# Altium schematic sheet WPL1321A(V1.0).SchDoc: WPL1321A(V1.0)
size A4 portrait; Revision: V1.0; PageSetup: Record=PageOptions|CenterHorizontal=True|CenterVertical=True|PrintScale=1.01|XCorrection=1.00|YCorrection=1.00|PrintKind=1|BorderSize=5000000|LeftOffset=0|BottomOffset=0|Orientation=2|PaperLength=1000|PaperWidth=1000|Scale=100|PaperSource=7|PrintQuality=600|MediaType=1|DitherType=10|PaperKind=A3|PrintScaleMode=1
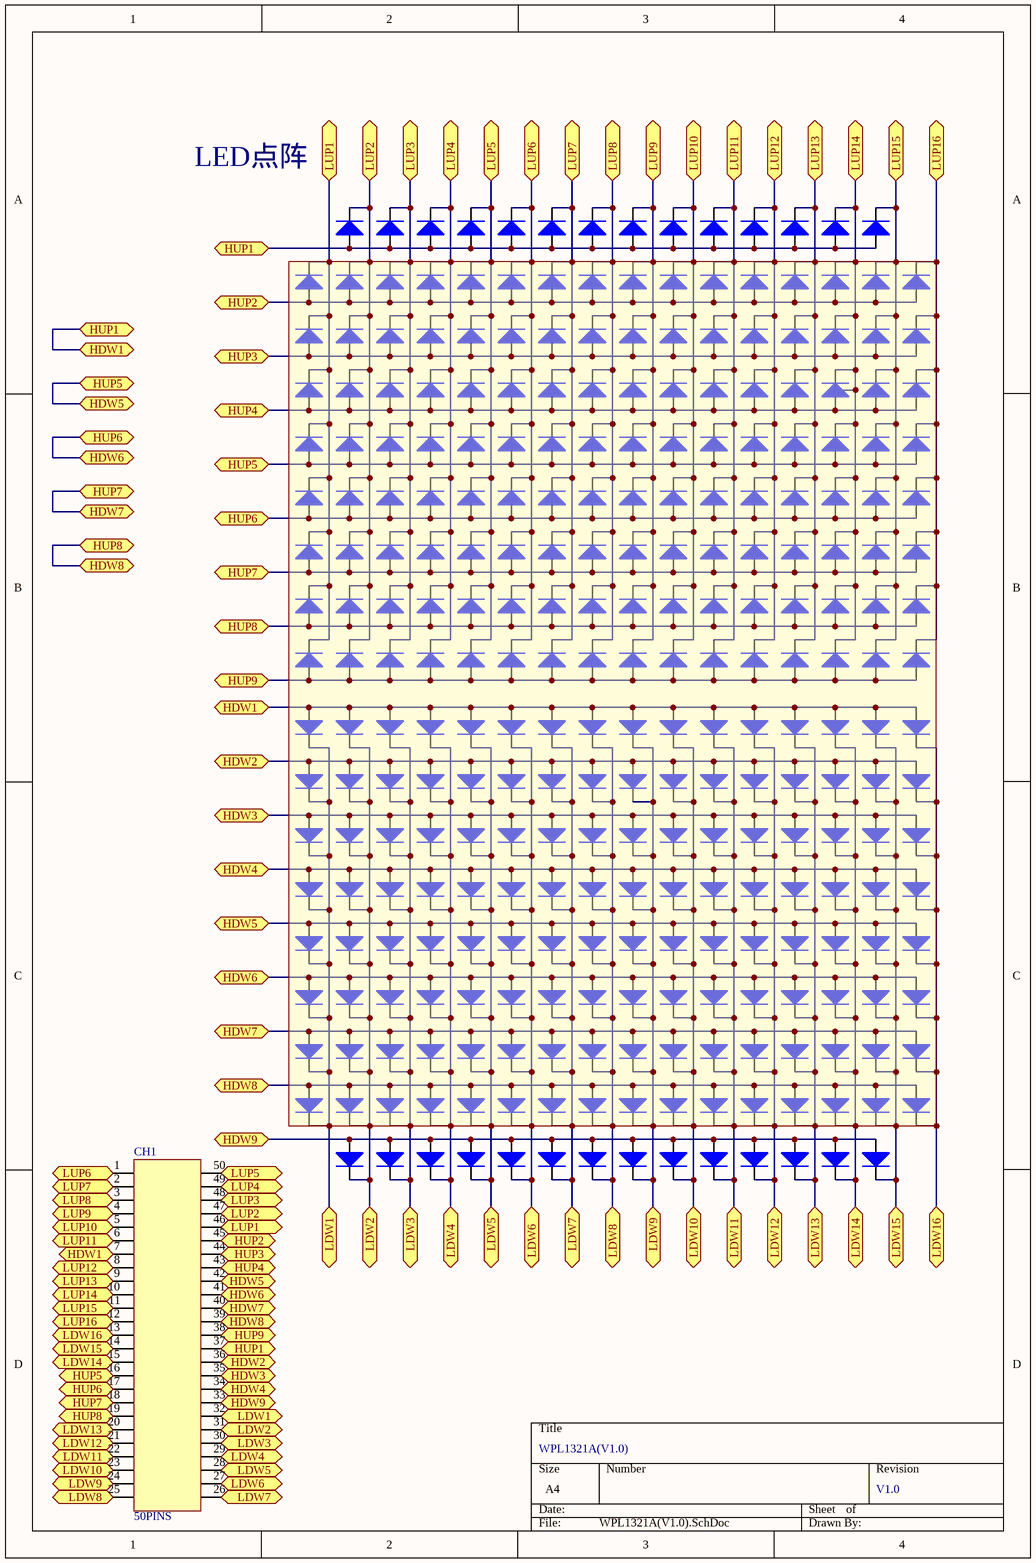
[diagram p0: WPL1321A(V1.0).SchDoc]

## Parts
CH1  50PINS  [50PINS]
D1  LED2  [RESC1608FL]  (value not drawn)
D2  LED2  [RESC1608FL]  (value not drawn)
D3  LED2  [RESC1608FL]  (value not drawn)
D4  LED2  [RESC1608FL]  (value not drawn)
D5  LED2  [RESC1608FL]  (value not drawn)
D6  LED2  [RESC1608FL]  (value not drawn)
D7  LED2  [RESC1608FL]  (value not drawn)
D8  LED2  [RESC1608FL]  (value not drawn)
D9  LED2  [RESC1608FL]  (value not drawn)
D10  LED2  [RESC1608FL]  (value not drawn)
D11  LED2  [RESC1608FL]  (value not drawn)
D12  LED2  [RESC1608FL]  (value not drawn)
D13  LED2  [RESC1608FL]  (value not drawn)
D14  LED2  [RESC1608FL]  (value not drawn)
D15  LED2  [RESC1608FL]  (value not drawn)
D16  LED2  [RESC1608FL]  (value not drawn)
D17  LED2  [RESC1608FL]  (value not drawn)
D18  LED2  [RESC1608FL]  (value not drawn)
D19  LED2  [RESC1608FL]  (value not drawn)
D20  LED2  [RESC1608FL]  (value not drawn)
D21  LED2  [RESC1608FL]  (value not drawn)
D22  LED2  [RESC1608FL]  (value not drawn)
D23  LED2  [RESC1608FL]  (value not drawn)
D24  LED2  [RESC1608FL]  (value not drawn)
D25  LED2  [RESC1608FL]  (value not drawn)
D26  LED2  [RESC1608FL]  (value not drawn)
D27  LED2  [RESC1608FL]  (value not drawn)
D28  LED2  [RESC1608FL]  (value not drawn)
D29  LED2  [RESC1608FL]  (value not drawn)
D30  LED2  [RESC1608FL]  (value not drawn)
D31  LED2  [RESC1608FL]  (value not drawn)
D32  LED2  [RESC1608FL]  (value not drawn)
D33  LED2  [RESC1608FL]  (value not drawn)
D34  LED2  [RESC1608FL]  (value not drawn)
D35  LED2  [RESC1608FL]  (value not drawn)
D36  LED2  [RESC1608FL]  (value not drawn)
D37  LED2  [RESC1608FL]  (value not drawn)
D38  LED2  [RESC1608FL]  (value not drawn)
D39  LED2  [RESC1608FL]  (value not drawn)
D40  LED2  [RESC1608FL]  (value not drawn)
D41  LED2  [RESC1608FL]  (value not drawn)
D42  LED2  [RESC1608FL]  (value not drawn)
D43  LED2  [RESC1608FL]  (value not drawn)
D44  LED2  [RESC1608FL]  (value not drawn)
D45  LED2  [RESC1608FL]  (value not drawn)
D46  LED2  [RESC1608FL]  (value not drawn)
D47  LED2  [RESC1608FL]  (value not drawn)
D48  LED2  [RESC1608FL]  (value not drawn)
D49  LED2  [RESC1608FL]  (value not drawn)
D50  LED2  [RESC1608FL]  (value not drawn)
D51  LED2  [RESC1608FL]  (value not drawn)
D52  LED2  [RESC1608FL]  (value not drawn)
D53  LED2  [RESC1608FL]  (value not drawn)
D54  LED2  [RESC1608FL]  (value not drawn)
D55  LED2  [RESC1608FL]  (value not drawn)
D56  LED2  [RESC1608FL]  (value not drawn)
D57  LED2  [RESC1608FL]  (value not drawn)
D58  LED2  [RESC1608FL]  (value not drawn)
D59  LED2  [RESC1608FL]  (value not drawn)
D60  LED2  [RESC1608FL]  (value not drawn)
D61  LED2  [RESC1608FL]  (value not drawn)
D62  LED2  [RESC1608FL]  (value not drawn)
D63  LED2  [RESC1608FL]  (value not drawn)
D64  LED2  [RESC1608FL]  (value not drawn)
D65  LED2  [RESC1608FL]  (value not drawn)
D66  LED2  [RESC1608FL]  (value not drawn)
D67  LED2  [RESC1608FL]  (value not drawn)
D68  LED2  [RESC1608FL]  (value not drawn)
D69  LED2  [RESC1608FL]  (value not drawn)
D70  LED2  [RESC1608FL]  (value not drawn)
D71  LED2  [RESC1608FL]  (value not drawn)
D72  LED2  [RESC1608FL]  (value not drawn)
D73  LED2  [RESC1608FL]  (value not drawn)
D74  LED2  [RESC1608FL]  (value not drawn)
D75  LED2  [RESC1608FL]  (value not drawn)
D76  LED2  [RESC1608FL]  (value not drawn)
D77  LED2  [RESC1608FL]  (value not drawn)
D78  LED2  [RESC1608FL]  (value not drawn)
D79  LED2  [RESC1608FL]  (value not drawn)
D80  LED2  [RESC1608FL]  (value not drawn)
D81  LED2  [RESC1608FL]  (value not drawn)
D82  LED2  [RESC1608FL]  (value not drawn)
D83  LED2  [RESC1608FL]  (value not drawn)
D84  LED2  [RESC1608FL]  (value not drawn)
D85  LED2  [RESC1608FL]  (value not drawn)
D86  LED2  [RESC1608FL]  (value not drawn)
D87  LED2  [RESC1608FL]  (value not drawn)
D88  LED2  [RESC1608FL]  (value not drawn)
D89  LED2  [RESC1608FL]  (value not drawn)
D90  LED2  [RESC1608FL]  (value not drawn)
D91  LED2  [RESC1608FL]  (value not drawn)
D92  LED2  [RESC1608FL]  (value not drawn)
D93  LED2  [RESC1608FL]  (value not drawn)
D94  LED2  [RESC1608FL]  (value not drawn)
D95  LED2  [RESC1608FL]  (value not drawn)
D96  LED2  [RESC1608FL]  (value not drawn)
D97  LED2  [RESC1608FL]  (value not drawn)
D98  LED2  [RESC1608FL]  (value not drawn)
D99  LED2  [RESC1608FL]  (value not drawn)
D100  LED2  [RESC1608FL]  (value not drawn)
D101  LED2  [RESC1608FL]  (value not drawn)
D102  LED2  [RESC1608FL]  (value not drawn)
D103  LED2  [RESC1608FL]  (value not drawn)
D104  LED2  [RESC1608FL]  (value not drawn)
D105  LED2  [RESC1608FL]  (value not drawn)
D106  LED2  [RESC1608FL]  (value not drawn)
D107  LED2  [RESC1608FL]  (value not drawn)
D108  LED2  [RESC1608FL]  (value not drawn)
D109  LED2  [RESC1608FL]  (value not drawn)
D110  LED2  [RESC1608FL]  (value not drawn)
D111  LED2  [RESC1608FL]  (value not drawn)
D112  LED2  [RESC1608FL]  (value not drawn)
D113  LED2  [RESC1608FL]  (value not drawn)
D114  LED2  [RESC1608FL]  (value not drawn)
D115  LED2  [RESC1608FL]  (value not drawn)
D116  LED2  [RESC1608FL]  (value not drawn)
D117  LED2  [RESC1608FL]  (value not drawn)
D118  LED2  [RESC1608FL]  (value not drawn)
D119  LED2  [RESC1608FL]  (value not drawn)
D120  LED2  [RESC1608FL]  (value not drawn)
D121  LED2  [RESC1608FL]  (value not drawn)
D122  LED2  [RESC1608FL]  (value not drawn)
D123  LED2  [RESC1608FL]  (value not drawn)
D124  LED2  [RESC1608FL]  (value not drawn)
D125  LED2  [RESC1608FL]  (value not drawn)
D126  LED2  [RESC1608FL]  (value not drawn)
D127  LED2  [RESC1608FL]  (value not drawn)
D128  LED2  [RESC1608FL]  (value not drawn)
D129  LED2  [RESC1608FL]  (value not drawn)
D130  LED2  [RESC1608FL]  (value not drawn)
D131  LED2  [RESC1608FL]  (value not drawn)
D132  LED2  [RESC1608FL]  (value not drawn)
D133  LED2  [RESC1608FL]  (value not drawn)
D134  LED2  [RESC1608FL]  (value not drawn)
D135  LED2  [RESC1608FL]  (value not drawn)
D136  LED2  [RESC1608FL]  (value not drawn)
D137  LED2  [RESC1608FL]  (value not drawn)
D138  LED2  [RESC1608FL]  (value not drawn)
D139  LED2  [RESC1608FL]  (value not drawn)
D140  LED2  [RESC1608FL]  (value not drawn)
D141  LED2  [RESC1608FL]  (value not drawn)
D142  LED2  [RESC1608FL]  (value not drawn)
D144  LED2  [RESC1608FL]  (value not drawn)
D145  LED2  [RESC1608FL]  (value not drawn)
D146  LED2  [RESC1608FL]  (value not drawn)
D147  LED2  [RESC1608FL]  (value not drawn)
D148  LED2  [RESC1608FL]  (value not drawn)
D149  LED2  [RESC1608FL]  (value not drawn)
D150  LED2  [RESC1608FL]  (value not drawn)
D151  LED2  [RESC1608FL]  (value not drawn)
D152  LED2  [RESC1608FL]  (value not drawn)
D153  LED2  [RESC1608FL]  (value not drawn)
D154  LED2  [RESC1608FL]  (value not drawn)
D155  LED2  [RESC1608FL]  (value not drawn)
D156  LED2  [RESC1608FL]  (value not drawn)
D157  LED2  [RESC1608FL]  (value not drawn)
D158  LED2  [RESC1608FL]  (value not drawn)
D159  LED2  [RESC1608FL]  (value not drawn)
D161  LED2  [RESC1608FL]  (value not drawn)
D162  LED2  [RESC1608FL]  (value not drawn)
D163  LED2  [RESC1608FL]  (value not drawn)
D164  LED2  [RESC1608FL]  (value not drawn)
D165  LED2  [RESC1608FL]  (value not drawn)
D166  LED2  [RESC1608FL]  (value not drawn)
D167  LED2  [RESC1608FL]  (value not drawn)
D168  LED2  [RESC1608FL]  (value not drawn)
D169  LED2  [RESC1608FL]  (value not drawn)
D170  LED2  [RESC1608FL]  (value not drawn)
D171  LED2  [RESC1608FL]  (value not drawn)
D172  LED2  [RESC1608FL]  (value not drawn)
D173  LED2  [RESC1608FL]  (value not drawn)
D174  LED2  [RESC1608FL]  (value not drawn)
D175  LED2  [RESC1608FL]  (value not drawn)
D176  LED2  [RESC1608FL]  (value not drawn)
D177  LED2  [RESC1608FL]  (value not drawn)
D178  LED2  [RESC1608FL]  (value not drawn)
D179  LED2  [RESC1608FL]  (value not drawn)
D180  LED2  [RESC1608FL]  (value not drawn)
D181  LED2  [RESC1608FL]  (value not drawn)
D182  LED2  [RESC1608FL]  (value not drawn)
D183  LED2  [RESC1608FL]  (value not drawn)
D184  LED2  [RESC1608FL]  (value not drawn)
D185  LED2  [RESC1608FL]  (value not drawn)
D186  LED2  [RESC1608FL]  (value not drawn)
D187  LED2  [RESC1608FL]  (value not drawn)
D188  LED2  [RESC1608FL]  (value not drawn)
D189  LED2  [RESC1608FL]  (value not drawn)
D190  LED2  [RESC1608FL]  (value not drawn)
D191  LED2  [RESC1608FL]  (value not drawn)
D192  LED2  [RESC1608FL]  (value not drawn)
D193  LED2  [RESC1608FL]  (value not drawn)
D194  LED2  [RESC1608FL]  (value not drawn)
D195  LED2  [RESC1608FL]  (value not drawn)
D196  LED2  [RESC1608FL]  (value not drawn)
D197  LED2  [RESC1608FL]  (value not drawn)
D198  LED2  [RESC1608FL]  (value not drawn)
D199  LED2  [RESC1608FL]  (value not drawn)
D200  LED2  [RESC1608FL]  (value not drawn)
D201  LED2  [RESC1608FL]  (value not drawn)
D202  LED2  [RESC1608FL]  (value not drawn)
D203  LED2  [RESC1608FL]  (value not drawn)
D204  LED2  [RESC1608FL]  (value not drawn)
D205  LED2  [RESC1608FL]  (value not drawn)
D206  LED2  [RESC1608FL]  (value not drawn)
D207  LED2  [RESC1608FL]  (value not drawn)
D208  LED2  [RESC1608FL]  (value not drawn)
D209  LED2  [RESC1608FL]  (value not drawn)
D210  LED2  [RESC1608FL]  (value not drawn)
D211  LED2  [RESC1608FL]  (value not drawn)
D212  LED2  [RESC1608FL]  (value not drawn)
D213  LED2  [RESC1608FL]  (value not drawn)
D214  LED2  [RESC1608FL]  (value not drawn)
D215  LED2  [RESC1608FL]  (value not drawn)
D216  LED2  [RESC1608FL]  (value not drawn)
D217  LED2  [RESC1608FL]  (value not drawn)
D218  LED2  [RESC1608FL]  (value not drawn)
D219  LED2  [RESC1608FL]  (value not drawn)
D220  LED2  [RESC1608FL]  (value not drawn)
D221  LED2  [RESC1608FL]  (value not drawn)
D222  LED2  [RESC1608FL]  (value not drawn)
D223  LED2  [RESC1608FL]  (value not drawn)
D224  LED2  [RESC1608FL]  (value not drawn)
D225  LED2  [RESC1608FL]  (value not drawn)
D226  LED2  [RESC1608FL]  (value not drawn)
D227  LED2  [RESC1608FL]  (value not drawn)
D228  LED2  [RESC1608FL]  (value not drawn)
D229  LED2  [RESC1608FL]  (value not drawn)
D230  LED2  [RESC1608FL]  (value not drawn)
D231  LED2  [RESC1608FL]  (value not drawn)
D232  LED2  [RESC1608FL]  (value not drawn)
D233  LED2  [RESC1608FL]  (value not drawn)
D234  LED2  [RESC1608FL]  (value not drawn)
D235  LED2  [RESC1608FL]  (value not drawn)
D236  LED2  [RESC1608FL]  (value not drawn)
D237  LED2  [RESC1608FL]  (value not drawn)
D238  LED2  [RESC1608FL]  (value not drawn)
D239  LED2  [RESC1608FL]  (value not drawn)
D240  LED2  [RESC1608FL]  (value not drawn)
D241  LED2  [RESC1608FL]  (value not drawn)
D242  LED2  [RESC1608FL]  (value not drawn)
D243  LED2  [RESC1608FL]  (value not drawn)
D244  LED2  [RESC1608FL]  (value not drawn)
D245  LED2  [RESC1608FL]  (value not drawn)
D246  LED2  [RESC1608FL]  (value not drawn)
D247  LED2  [RESC1608FL]  (value not drawn)
D248  LED2  [RESC1608FL]  (value not drawn)
D249  LED2  [RESC1608FL]  (value not drawn)
D250  LED2  [RESC1608FL]  (value not drawn)
D251  LED2  [RESC1608FL]  (value not drawn)
D252  LED2  [RESC1608FL]  (value not drawn)
D253  LED2  [RESC1608FL]  (value not drawn)
D254  LED2  [RESC1608FL]  (value not drawn)
D255  LED2  [RESC1608FL]  (value not drawn)
D256  LED2  [RESC1608FL]  (value not drawn)
D257  LED2  [RESC1608FL]  (value not drawn)
D258  LED2  [RESC1608FL]  (value not drawn)
D259  LED2  [RESC1608FL]  (value not drawn)
D260  LED2  [RESC1608FL]  (value not drawn)
D261  LED2  [RESC1608FL]  (value not drawn)
D262  LED2  [RESC1608FL]  (value not drawn)
D263  LED2  [RESC1608FL]  (value not drawn)
D264  LED2  [RESC1608FL]  (value not drawn)
D265  LED2  [RESC1608FL]  (value not drawn)
D266  LED2  [RESC1608FL]  (value not drawn)
D267  LED2  [RESC1608FL]  (value not drawn)
D268  LED2  [RESC1608FL]  (value not drawn)
D269  LED2  [RESC1608FL]  (value not drawn)
D270  LED2  [RESC1608FL]  (value not drawn)
D271  LED2  [RESC1608FL]  (value not drawn)
D272  LED2  [RESC1608FL]  (value not drawn)
D273  LED2  [RESC1608FL]  (value not drawn)
D274  LED2  [RESC1608FL]  (value not drawn)
D275  LED2  [RESC1608FL]  (value not drawn)
D276  LED2  [RESC1608FL]  (value not drawn)
D277  LED2  [RESC1608FL]  (value not drawn)
D278  LED2  [RESC1608FL]  (value not drawn)
D279  LED2  [RESC1608FL]  (value not drawn)
D280  LED2  [RESC1608FL]  (value not drawn)
D281  LED2  [RESC1608FL]  (value not drawn)
D282  LED2  [RESC1608FL]  (value not drawn)
D283  LED2  [RESC1608FL]  (value not drawn)
D284  LED2  [RESC1608FL]  (value not drawn)
D285  LED2  [RESC1608FL]  (value not drawn)
D286  LED2  [RESC1608FL]  (value not drawn)

## Ports
HDW1 (bidir), HDW2 (bidir), HDW3 (bidir), HDW4 (bidir), HDW5 (bidir), HDW6 (bidir), HDW7 (bidir), HDW8 (bidir), HDW9 (bidir), HUP1 (bidir), HUP2 (bidir), HUP3 (bidir), HUP4 (bidir), HUP5 (bidir), HUP6 (bidir), HUP7 (bidir), HUP8 (bidir), HUP9 (bidir), LDW1 (bidir), LDW2 (bidir), LDW3 (bidir), LDW4 (bidir), LDW5 (bidir), LDW6 (bidir), LDW7 (bidir), LDW8 (bidir), LDW9 (bidir), LDW10 (bidir), LDW11 (bidir), LDW12 (bidir), LDW13 (bidir), LDW14 (bidir), LDW15 (bidir), LDW16 (bidir), LUP1 (bidir), LUP2 (bidir), LUP3 (bidir), LUP4 (bidir), LUP5 (bidir), LUP6 (bidir), LUP7 (bidir), LUP8 (bidir), LUP9 (bidir), LUP10 (bidir), LUP11 (bidir), LUP12 (bidir), LUP13 (bidir), LUP14 (bidir), LUP15 (bidir), LUP16 (bidir)

## Nets
HDW1: CH1.7 CH1.37 D1.1(A) D2.1(A) D3.1(A) D4.1(A) D5.1(A) D6.1(A) D7.1(A) D8.1(A) D9.1(A) D10.1(A) D11.1(A) D12.1(A) D13.1(A) D14.1(A) D144.1(A) D145.1(A) D146.1(A) D147.1(A) D148.1(A) D149.1(A) D150.1(A) D151.1(A) D152.1(A) D153.1(A) D154.1(A) D155.1(A) D156.1(A) D157.1(A) D158.1(A) D159.1(A) ; port HUP1, port HDW1
HDW2: CH1.36 D161.1(A) D162.1(A) D163.1(A) D164.1(A) D165.1(A) D166.1(A) D167.1(A) D168.1(A) D169.1(A) D170.1(A) D171.1(A) D172.1(A) D173.1(A) D174.1(A) D175.1(A) D176.1(A) ; port HDW2
HDW3: CH1.35 D177.1(A) D178.1(A) D179.1(A) D180.1(A) D181.1(A) D182.1(A) D183.1(A) D184.1(A) D185.1(A) D186.1(A) D187.1(A) D188.1(A) D189.1(A) D190.1(A) D191.1(A) D192.1(A) ; port HDW3
HDW4: CH1.34 D193.1(A) D194.1(A) D195.1(A) D196.1(A) D197.1(A) D198.1(A) D199.1(A) D200.1(A) D201.1(A) D202.1(A) D203.1(A) D204.1(A) D205.1(A) D206.1(A) D207.1(A) D208.1(A) ; port HDW4
HDW5: CH1.16 CH1.42 D63.1(A) D64.1(A) D65.1(A) D66.1(A) D67.1(A) D68.1(A) D69.1(A) D70.1(A) D71.1(A) D72.1(A) D73.1(A) D74.1(A) D75.1(A) D76.1(A) D77.1(A) D78.1(A) D209.1(A) D210.1(A) D211.1(A) D212.1(A) D213.1(A) D214.1(A) D215.1(A) D216.1(A) D217.1(A) D218.1(A) D219.1(A) D220.1(A) D221.1(A) D222.1(A) D223.1(A) D224.1(A) ; port HUP5, port HDW5
HDW6: CH1.17 CH1.41 D79.1(A) D80.1(A) D81.1(A) D82.1(A) D83.1(A) D84.1(A) D85.1(A) D86.1(A) D87.1(A) D88.1(A) D89.1(A) D90.1(A) D91.1(A) D92.1(A) D93.1(A) D94.1(A) D225.1(A) D226.1(A) D227.1(A) D228.1(A) D229.1(A) D230.1(A) D231.1(A) D232.1(A) D233.1(A) D234.1(A) D235.1(A) D236.1(A) D237.1(A) D238.1(A) D239.1(A) D240.1(A) ; port HUP6, port HDW6
HDW7: CH1.18 CH1.40 D95.1(A) D96.1(A) D97.1(A) D98.1(A) D99.1(A) D100.1(A) D101.1(A) D102.1(A) D103.1(A) D104.1(A) D105.1(A) D106.1(A) D107.1(A) D108.1(A) D109.1(A) D110.1(A) D241.1(A) D242.1(A) D243.1(A) D244.1(A) D245.1(A) D246.1(A) D247.1(A) D248.1(A) D249.1(A) D250.1(A) D251.1(A) D252.1(A) D253.1(A) D254.1(A) D255.1(A) D256.1(A) ; port HUP7, port HDW7
HDW8: CH1.19 CH1.39 D111.1(A) D112.1(A) D113.1(A) D114.1(A) D115.1(A) D116.1(A) D117.1(A) D118.1(A) D119.1(A) D120.1(A) D121.1(A) D122.1(A) D123.1(A) D124.1(A) D125.1(A) D126.1(A) D257.1(A) D258.1(A) D259.1(A) D260.1(A) D261.1(A) D262.1(A) D263.1(A) D264.1(A) D265.1(A) D266.1(A) D267.1(A) D268.1(A) D269.1(A) D270.1(A) D271.1(A) D272.1(A) ; port HUP8, port HDW8
HDW9: CH1.33 D273.1(A) D274.1(A) D275.1(A) D276.1(A) D277.1(A) D278.1(A) D279.1(A) D280.1(A) D281.1(A) D282.1(A) D283.1(A) D284.1(A) D285.1(A) D286.1(A) ; port HDW9
HUP2: CH1.45 D15.1(A) D16.1(A) D17.1(A) D18.1(A) D19.1(A) D20.1(A) D21.1(A) D22.1(A) D23.1(A) D24.1(A) D25.1(A) D26.1(A) D27.1(A) D28.1(A) D29.1(A) D30.1(A) ; port HUP2
HUP3: CH1.44 D31.1(A) D32.1(A) D33.1(A) D34.1(A) D35.1(A) D36.1(A) D37.1(A) D38.1(A) D39.1(A) D40.1(A) D41.1(A) D42.1(A) D43.1(A) D44.1(A) D45.1(A) D46.1(A) ; port HUP3
HUP4: CH1.43 D47.1(A) D48.1(A) D49.1(A) D50.1(A) D51.1(A) D52.1(A) D53.1(A) D54.1(A) D55.1(A) D56.1(A) D57.1(A) D58.1(A) D59.1(A) D60.1(A) D61.1(A) D62.1(A) ; port HUP4
HUP9: CH1.38 D127.1(A) D128.1(A) D129.1(A) D130.1(A) D131.1(A) D132.1(A) D133.1(A) D134.1(A) D135.1(A) D136.1(A) D137.1(A) D138.1(A) D139.1(A) D140.1(A) D141.1(A) D142.1(A) ; port HUP9
LDW1: CH1.32 D144.2(K) D161.2(K) D177.2(K) D193.2(K) D209.2(K) D225.2(K) D241.2(K) D257.2(K) ; port LDW1
LDW2: CH1.31 D145.2(K) D162.2(K) D178.2(K) D194.2(K) D210.2(K) D226.2(K) D242.2(K) D258.2(K) D273.2(K) ; port LDW2
LDW3: CH1.30 D146.2(K) D163.2(K) D179.2(K) D195.2(K) D211.2(K) D227.2(K) D243.2(K) D259.2(K) D274.2(K) ; port LDW3
LDW4: CH1.29 D147.2(K) D164.2(K) D180.2(K) D196.2(K) D212.2(K) D228.2(K) D244.2(K) D260.2(K) D275.2(K) ; port LDW4
LDW5: CH1.28 D148.2(K) D165.2(K) D181.2(K) D197.2(K) D213.2(K) D229.2(K) D245.2(K) D261.2(K) D276.2(K) ; port LDW5
LDW6: CH1.27 D149.2(K) D166.2(K) D182.2(K) D198.2(K) D214.2(K) D230.2(K) D246.2(K) D262.2(K) D277.2(K) ; port LDW6
LDW7: CH1.26 D150.2(K) D167.2(K) D183.2(K) D199.2(K) D215.2(K) D231.2(K) D247.2(K) D263.2(K) D278.2(K) ; port LDW7
LDW8: CH1.25 D151.2(K) D168.2(K) D184.2(K) D200.2(K) D216.2(K) D232.2(K) D248.2(K) D264.2(K) D279.2(K) ; port LDW8
LDW9: CH1.24 D152.2(K) D169.2(K) D185.2(K) D201.2(K) D217.2(K) D233.2(K) D249.2(K) D265.2(K) D280.2(K) ; port LDW9
LDW10: CH1.23 D153.2(K) D170.2(K) D186.2(K) D202.2(K) D218.2(K) D234.2(K) D250.2(K) D266.2(K) D281.2(K) ; port LDW10
LDW11: CH1.22 D154.2(K) D171.2(K) D187.2(K) D203.2(K) D219.2(K) D235.2(K) D251.2(K) D267.2(K) D282.2(K) ; port LDW11
LDW12: CH1.21 D155.2(K) D172.2(K) D188.2(K) D204.2(K) D220.2(K) D236.2(K) D252.2(K) D268.2(K) D283.2(K) ; port LDW12
LDW13: CH1.20 D156.2(K) D173.2(K) D189.2(K) D205.2(K) D221.2(K) D237.2(K) D253.2(K) D269.2(K) D284.2(K) ; port LDW13
LDW14: CH1.15 D157.2(K) D174.2(K) D190.2(K) D206.2(K) D222.2(K) D238.2(K) D254.2(K) D270.2(K) D285.2(K) ; port LDW14
LDW15: CH1.14 D158.2(K) D175.2(K) D191.2(K) D207.2(K) D223.2(K) D239.2(K) D255.2(K) D271.2(K) D286.2(K) ; port LDW15
LDW16: CH1.13 D159.2(K) D176.2(K) D192.2(K) D208.2(K) D224.2(K) D240.2(K) D256.2(K) D272.2(K) ; port LDW16
LUP1: CH1.46 D15.2(K) D31.2(K) D47.2(K) D63.2(K) D79.2(K) D95.2(K) D111.2(K) D127.2(K) ; port LUP1
LUP2: CH1.47 D1.2(K) D16.2(K) D32.2(K) D48.2(K) D64.2(K) D80.2(K) D96.2(K) D112.2(K) D128.2(K) ; port LUP2
LUP3: CH1.48 D2.2(K) D17.2(K) D33.2(K) D49.2(K) D65.2(K) D81.2(K) D97.2(K) D113.2(K) D129.2(K) ; port LUP3
LUP4: CH1.49 D3.2(K) D18.2(K) D34.2(K) D50.2(K) D66.2(K) D82.2(K) D98.2(K) D114.2(K) D130.2(K) ; port LUP4
LUP5: CH1.50 D4.2(K) D19.2(K) D35.2(K) D51.2(K) D67.2(K) D83.2(K) D99.2(K) D115.2(K) D131.2(K) ; port LUP5
LUP6: CH1.1 D5.2(K) D20.2(K) D36.2(K) D52.2(K) D68.2(K) D84.2(K) D100.2(K) D116.2(K) D132.2(K) ; port LUP6
LUP7: CH1.2 D6.2(K) D21.2(K) D37.2(K) D53.2(K) D69.2(K) D85.2(K) D101.2(K) D117.2(K) D133.2(K) ; port LUP7
LUP8: CH1.3 D7.2(K) D22.2(K) D38.2(K) D54.2(K) D70.2(K) D86.2(K) D102.2(K) D118.2(K) D134.2(K) ; port LUP8
LUP9: CH1.4 D8.2(K) D23.2(K) D39.2(K) D55.2(K) D71.2(K) D87.2(K) D103.2(K) D119.2(K) D135.2(K) ; port LUP9
LUP10: CH1.5 D9.2(K) D24.2(K) D40.2(K) D56.2(K) D72.2(K) D88.2(K) D104.2(K) D120.2(K) D136.2(K) ; port LUP10
LUP11: CH1.6 D10.2(K) D25.2(K) D41.2(K) D57.2(K) D73.2(K) D89.2(K) D105.2(K) D121.2(K) D137.2(K) ; port LUP11
LUP12: CH1.8 D11.2(K) D26.2(K) D42.2(K) D58.2(K) D74.2(K) D90.2(K) D106.2(K) D122.2(K) D138.2(K) ; port LUP12
LUP13: CH1.9 D12.2(K) D27.2(K) D43.2(K) D59.2(K) D75.2(K) D91.2(K) D107.2(K) D123.2(K) D139.2(K) ; port LUP13
LUP14: CH1.10 D13.2(K) D28.2(K) D44.2(K) D60.2(K) D76.2(K) D92.2(K) D108.2(K) D124.2(K) D140.2(K) ; port LUP14
LUP15: CH1.11 D14.2(K) D29.2(K) D45.2(K) D61.2(K) D77.2(K) D93.2(K) D109.2(K) D125.2(K) D141.2(K) ; port LUP15
LUP16: CH1.12 D30.2(K) D46.2(K) D62.2(K) D78.2(K) D94.2(K) D110.2(K) D126.2(K) D142.2(K) ; port LUP16

## Notes on the sheet
- LED点阵

## Library data of the parts
D1-D142 D144-D159 D161-D286 = LED2: Typical RED, GREEN, YELLOW, AMBER GaAs LED; Published: 8-Jun-2000; LatestRevisionDate: 17-Jul-2002; LatestRevisionNote: Re-released for DXP Platform.; PackageVersion: Feb-2002; PackageReference: 3.2X1.6X1.1; Publisher: Altium Limited